# Altium schematic sheet ModLCDDisplay.SchDoc
size 420 x 297 mm; Address1: Address1; Address2: Address2; Address3: Address3; Address4: Address4; SheetNumber: 1; Scale: 1:1; Разраб.: Лепотенко А.С.; Обозначение документа: ЛАС.4367523.003Э3; Перв. применение: ЛАС.4367523.003; Наименование изделия 1: Блок индикации; Наименование изделия 2: Схема электрическая; Наименование изделия 3: принципиальная; Нач. отд.: Нач. отд.
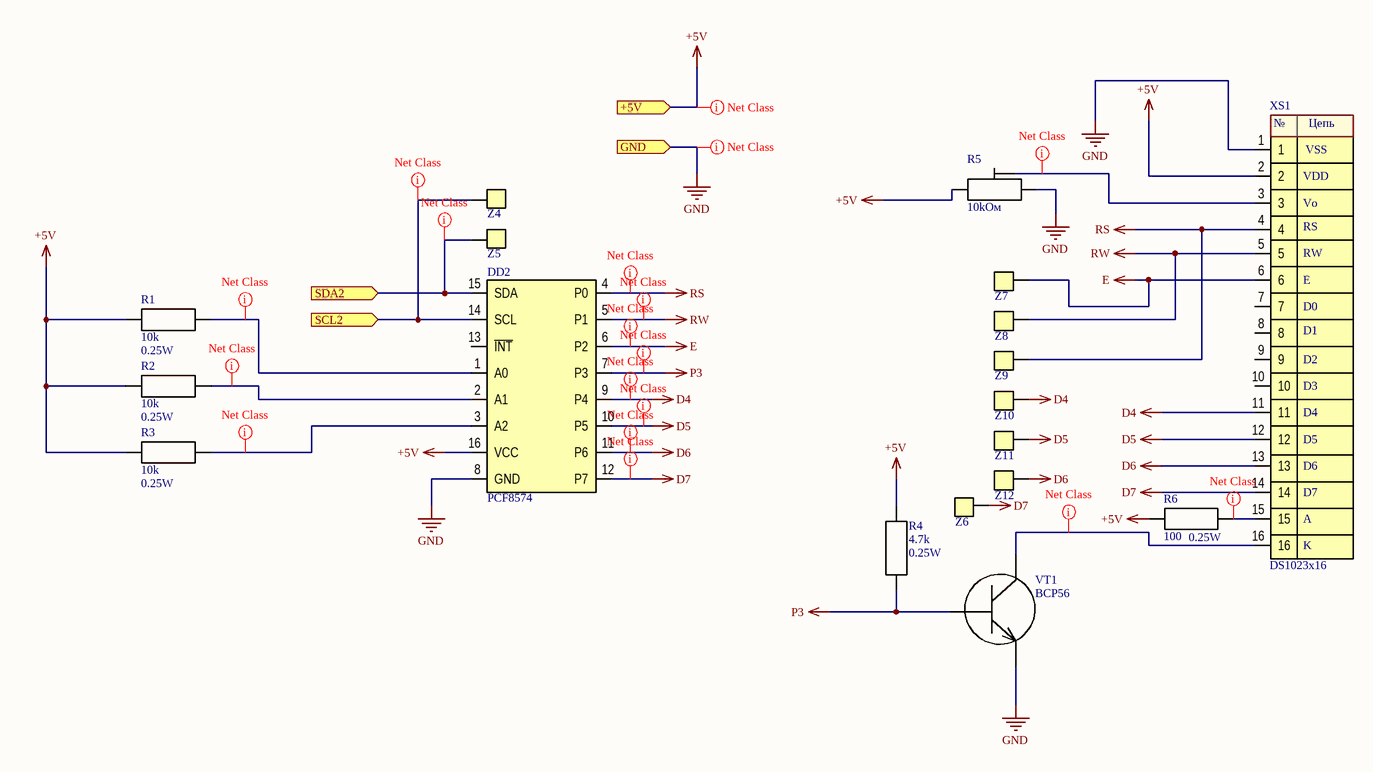
[diagram p0: ModLCDDisplay.SchDoc]

## Parts
DD2  PCF8574  [SO-16]
R1  Power: 0.25W  [1206]  (hidden comment: 10k)
R2  Power: 0.25W  [1206]  (hidden comment: 10k)
R3  Power: 0.25W  [1206]  (hidden comment: 10k)
R4  value 4.7k  Power: 0.25W  [1206]  (hidden comment: 4k7)
R5  10kОм  [3006P]
R6  Power: 0.25W  [1206]  (hidden comment: 100)
VT1  BCP56  [SOT223]
XS1  DS1023x16  [DS1023-2.54x16x1]
Z4  test Point  [test Point]  (value not drawn)
Z5  test Point  [test Point]  (value not drawn)
Z6  test Point  [test Point]  (value not drawn)
Z7  test Point  [test Point]  (value not drawn)
Z8  test Point  [test Point]  (value not drawn)
Z9  test Point  [test Point]  (value not drawn)
Z10  test Point  [test Point]  (value not drawn)
Z11  test Point  [test Point]  (value not drawn)
Z12  test Point  [test Point]  (value not drawn)

## Ports
+5V (in), GND (in), SCL2 (in), SDA2 (in)

## Nets
+5V: DD2.16(VCC) R1.1 R2.1 R3.1 R4.2 R5.1 R6.1 XS1.2 ; port +5V
D4: DD2.9(P4) XS1.11 Z10.1
D5: DD2.10(P5) XS1.12 Z11.1
D6: DD2.11(P6) XS1.13 Z12.1
D7: DD2.12(P7) XS1.14 Z6.1
E: DD2.6(P2) XS1.6 Z7.1
GND: DD2.8(GND) R5.3 VT1.3 XS1.1 ; port GND
P3: DD2.7(P3) R4.1 VT1.1
RS: DD2.4(P0) XS1.4 Z9.1
RW: DD2.5(P1) XS1.5 Z8.1
SCL2: DD2.14(SCL) Z4.1 ; port SCL2
SDA2: DD2.15(SDA) Z5.1 ; port SDA2
NetDD2_1: DD2.1(A0) R1.2
NetDD2_2: DD2.2(A1) R2.2
NetDD2_3: DD2.3(A2) R3.2
NetR5_2: R5.2 XS1.3
NetR6_2: R6.2 XS1.15
NetVT1_2: VT1.2 XS1.16

Not connected (* = marked no-connect by the designer): DD2 13(~{INT}); XS1 7 8 9 10

## Layout directives
net class DigitalNet: D4, D5, D6, D7, E, P3, RS, RW, SCL2, SDA2
net class Power5V_3V3: +5V, NetDD2_1, NetDD2_2, NetDD2_3, NetR5_2, NetR6_2, NetVT1_2
net class Power24V: GND

## Notes on the sheet
- Перв. примен.
- Справ. №
- Подп. и дата
- Инв. № дубл.
- Взам. инв. №
- Разраб.
- Изм.
- Лист
- № докум.
- Подп.
- Дата
- Лит.
- Масса
- Масштаб
- Пров.
- Т.контр.
- Листов
- Инв. № подл.
- Утв.
- Н.контр.
- Копировал
- Формат А3
- (in symbol DS1023x2.54x16x1) №; Цепь; VSS; VDD; Vo; RS; RW; E; D0; D1; D2; D3; D4; D5; D6; D7; A; K

## Library data of the parts
DD2 = PCF8574: part Number: PCF8574DW; Manufacturer: Texas Instruments; Value: IC; Package: SO-16; Price: 1.585; ShoppingPlace: http://belchip.by/product/?selected_product=29967; Quantity: 3
R1-R3 = Resistor: Manufacturer: YAGEO; Part Number: RC1206FR-0710KL; Quntity: 4; Price: 0.15; Package: 1206; ShoppingPlace: http://belchip.by/product/?selected_product=30985; Value: 10k
R4 = Resistor: Manufacturer: YAGEO; Part Number: RC1206JR-074K7L; Quntity: 4; Price: 0,15; Package: 1206; ShoppingPlace: http://belchip.by/product/?selected_product=01399
R5 = POT: Part Number: 3006-103-Z-LF; Manufacturer: Bours; Power: 0,125W; Package: 3006; Price: 0,445; ShoppingPlace: http://belchip.by/product/?selected_product=32831; Value: 10kОм; Quantity: 1
R6 = Resistor: Manufacturer: YAGEO; Part Number: RC1206FR-07100RL; Quntity: 4; Price: 0.15; Package: 1206; ShoppingPlace: http://belchip.by/product/?selected_product=18520; Value: 100
VT1 = BCP56-16: Manufacturer: NXP Semiconductors; Part Number: BCP56-16; Price: BCP56; ShoppingPlace: http://belchip.by/product/?selected_product=12583; Quantity: 2; Package: SOT223
XS1 = DS1023x2.54x16x1: Manufacturer: Ningbo connfly electronic; Part Number: DS1023-1*16S21; Value: 500VDC; Package: DS1023; Price: 0.12; ShoppingPlace: https://www.ru-chipdip.by/product/pbs16; Quantity: 4